# EAGLE design reader (EAGLE 9.1.0)
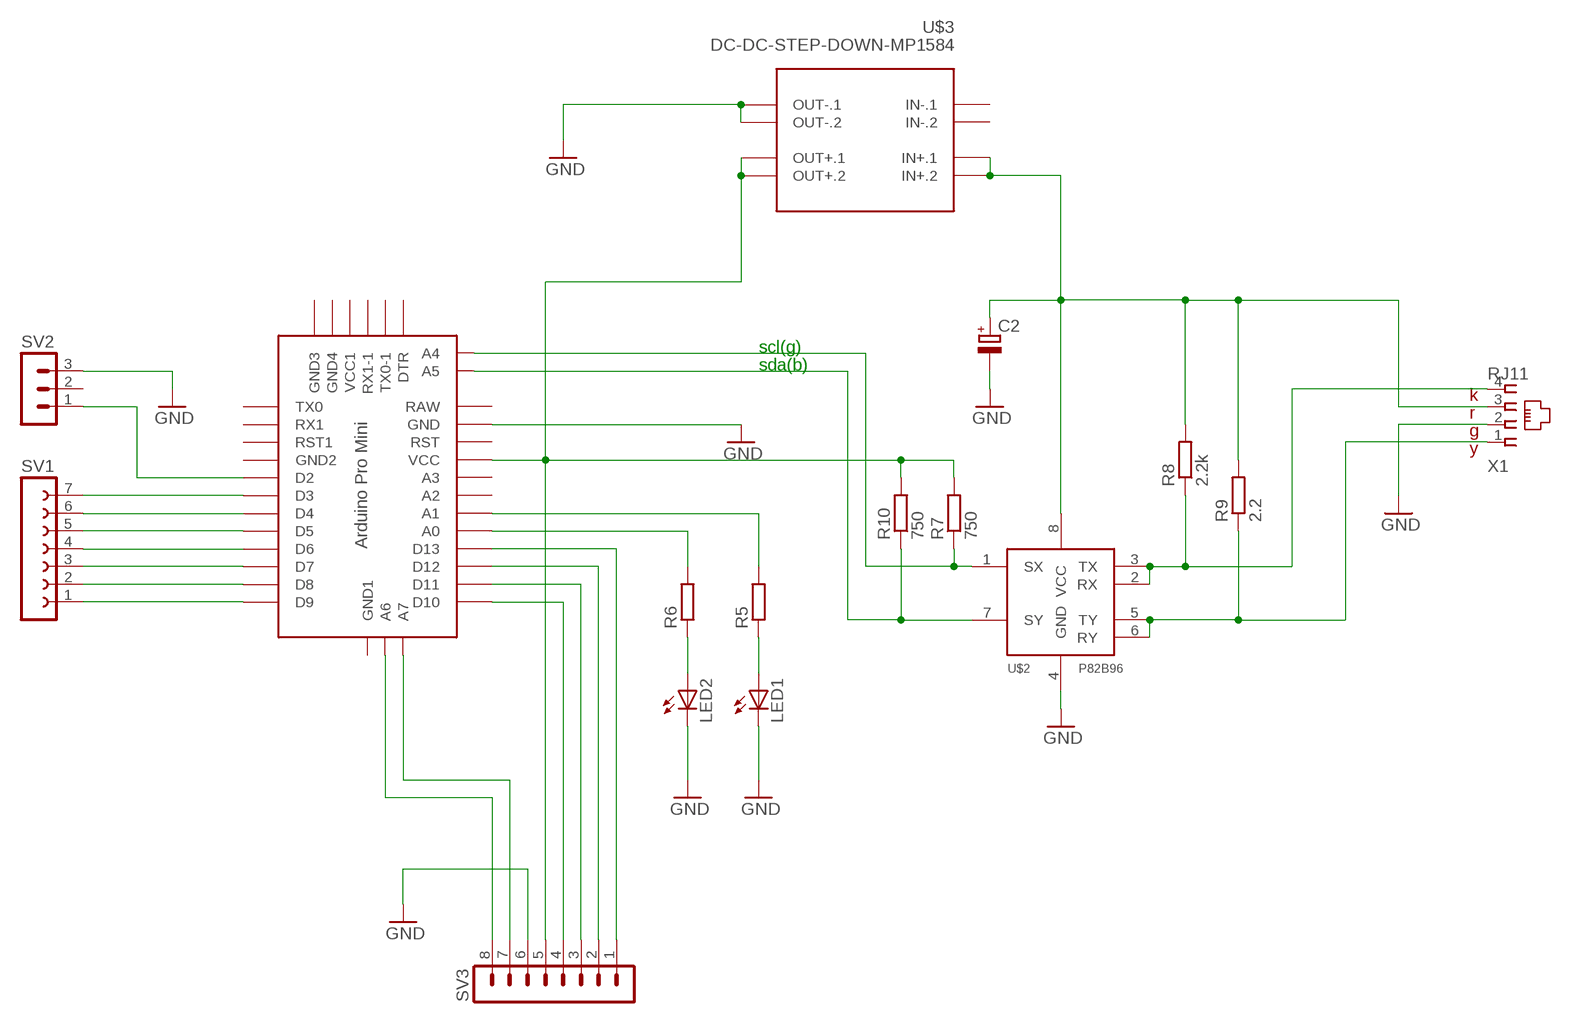
[diagram p0: schematic, sheet 1]

## Parts
C2  CPOL-EUE5-6  [E5-6]
LED1  LEDB152  [Q62902-B152]
LED2  LEDB152  [Q62902-B152]
R5  R-EU_M1206  [M1206]
R6  R-EU_M1206  [M1206]
R7  750  R-EU_M1206  [M1206]
R8  2.2k  R-EU_M1206  [M1206]
R9  2.2  R-EU_M1206  [M1206]
R10  750  R-EU_M1206  [M1206]
SV1  FE07-1  [FE07]
SV2  MA03-1  [MA03-1]
SV3  MA08-1  [MA08-1]
U$1  ABK-PRO-MINI  [ABK-PRO-MINI]
U$2  P82B96_  [SOIC8]
U$3  DC-DC-STEP-DOWN-MP1584  [DC-DC-STEP-DOWN-MP1584]
X1  RJ11  [RJ11-4P4C]

## Nets
GND: C2.- LED1.K(C) LED2.K(C) SV2.3 SV3.6 U$1.GND U$2.4(GND) U$3.OUT-.1 U$3.OUT-.2 X1.2
N$1: SV1.1 U$1.D9
N$3: R7.1 U$1.A4 U$2.1(SX)
N$4: R10.1 U$1.A5 U$2.7(SY)
N$5: R8.1 U$2.2(RX) U$2.3(TX) X1.4
N$6: SV3.1 U$1.D13
N$7: R9.1 U$2.5(TY) U$2.6(RY) X1.1
N$8: SV1.2 U$1.D8
N$9: C2.+ R8.2 R9.2 U$2.8(VCC) U$3.IN+.1 U$3.IN+.2 X1.3
N$10: SV1.3 U$1.D7
N$11: SV1.4 U$1.D6
N$12: SV1.5 U$1.D5
N$13: SV1.6 U$1.D4
N$14: SV1.7 U$1.D3
N$15: SV3.2 U$1.D12
N$16: SV2.1 U$1.D2
N$17: R5.2 U$1.A1
N$18: R6.2 U$1.A0
N$19: LED1.A R5.1
N$20: LED2.A R6.1
N$21: SV3.3 U$1.D11
N$22: R7.2 R10.2 SV3.5 U$1.VCC U$3.OUT+.1 U$3.OUT+.2
N$23: SV3.4 U$1.D10
N$24: SV3.7 U$1.A7
N$25: SV3.8 U$1.A6
Unconnected: SV2.2 U$1.A2 U$1.A3 U$1.DTR U$1.GND1(GND2) U$1.GND2(GND3) U$1.GND3(GND4) U$1.GND4(GND1) U$1.RAW U$1.RST U$1.RST1 U$1.RX1 U$1.RX1-1 U$1.TX0 U$1.TX0-1 U$1.VCC1 U$3.IN-.1 U$3.IN-.2

## Notes on the sheet
- scl(g)
- sda(b)

## Library data of the parts
C2 = rcl:CPOL-EU: POLARIZED CAPACITOR, European symbol; SPICEPREFIX: C
LED1 LED2 = led:LED: LED OSRAM: - CHIPLED LG R971, LG N971, LY N971, LG Q971, LY Q971, LO R971, LY R971 LH N974, LH R974 LS Q976, LO Q976, LY Q976 LO Q996 - Hyper CHIPLED LW Q18S LB Q993, LB Q99A, LB R99A - SideLED LS A670, LO A670, LY A670, LG A670, LP A670 LB A673, LV A673, LT A673, LW A673 LH A674 LY A675 LS A676, LA A676, LO A676, LY A676, LW A676 LS A679, LY A679, LG A679 - Hyper Micro SIDELED® LS Y876, LA Y876, LO Y876, LY Y876 LT Y87S - SmartLED LW L88C, LW L88S LB L89C, LB L89S, LG L890 LS L89K, LO L89K, LY L89K LS L896, LA L896, LO L896, LY L896 - TOPLED LS T670, LO T670, LY T670, LG T670, LP T670 LSG T670, LSP T670, LSY T670, LOP T670, LYG T670 LG T671, LOG T671, LSG T671 LB T673, LV T673, LT T673, LW T673 LH T674 LS T676, LA T676, LO T676, LY T676, LB T676, LH T676, LSB T676, LW T676 LB T67C, LV T67C, LT T67C, LS T67K, LO T67K, LY T67K, LW E67C LS E67B, LA E67B, LO E67B, LY E67B, LB E67C, LV E67C, LT E67C LW T67C LS T679, LY T679, LG T679 LS T770, LO T770, LY T770, LG T770, LP T770 LB T773, LV T773, LT T773, LW T773 LH T774 LS E675, LA E675, LY E675, LS T675 LS T776, LA T776, LO T776, LY T776, LB T776 LHGB T686 LT T68C, LB T68C - Hyper Mini TOPLED® LB M676 - Mini TOPLED Santana® LG M470 LS M47K, LO M47K, LY M47K Source: http://www.osram.convergy.de LUXEON: - LUMILED® LXK2-PW12-R00, LXK2-PW12-S00, LXK2-PW14-U00, LXK2-PW14-V00 LXK2-PM12-R00, LXK2-PM12-S00, LXK2-PM14-U00 LXK2-PE12-Q00, LXK2-PE12-R00, LXK2-PE12-S00, LXK2-PE14-T00, LXK2-PE14-U00 LXK2-PB12-K00, LXK2-PB12-L00, LXK2-PB12-M00, LXK2-PB14-N00, LXK2-PB14-P00, LXK2-PB14-Q00 LXK2-PR12-L00, LXK2-PR12-M00, LXK2-PR14-Q00, LXK2-PR14-R00 LXK2-PD12-Q00, LXK2-PD12-R00, LXK2-PD12-S00 LXK2-PH12-R00, LXK2-PH12-S00 LXK2-PL12-P00, LXK2-PL12-Q00, LXK2-PL12-R00 Source: www.luxeon.com KINGBRIGHT: KA-3528ASYC Source: www.kingbright.com
R5-R10 = rcl:R-EU_: RESISTOR, European symbol; SPICEPREFIX: R
SV1 = con-lsta:FE07-1: FEMALE HEADER; OC_FARNELL: unknown; OC_NEWARK: unknown
SV2 = con-lstb:MA03-1: PIN HEADER; OC_FARNELL: unknown; OC_NEWARK: unknown
SV3 = con-lstb:MA08-1: PIN HEADER; OC_FARNELL: unknown; OC_NEWARK: unknown
U$1 = Arduino-clone:ABK-PRO-MINI: ABK Pro-Mini Arduino Clone
U$2 = P82B96:P82B96_: P82B96 - I2C buffer
U$3 = diy-modules:DC-DC-STEP-DOWN-MP1584: DC/DC Step-Down Regulator based on MP1584 chip MP1584 datasheet available here: http://www.haoyuelectronics.com/Attachment/MP1584/MP1584.pdf Click here to find device on ebay.com <http://www.ebay.com/sch/mp1584+module>
X1 = con-4ucon:RJ11: RJ11 Connector Source: 4UCON TECHNOLOGY INC. 14867.pdf; OC_FARNELL: unknown; OC_NEWARK: unknown

## Board
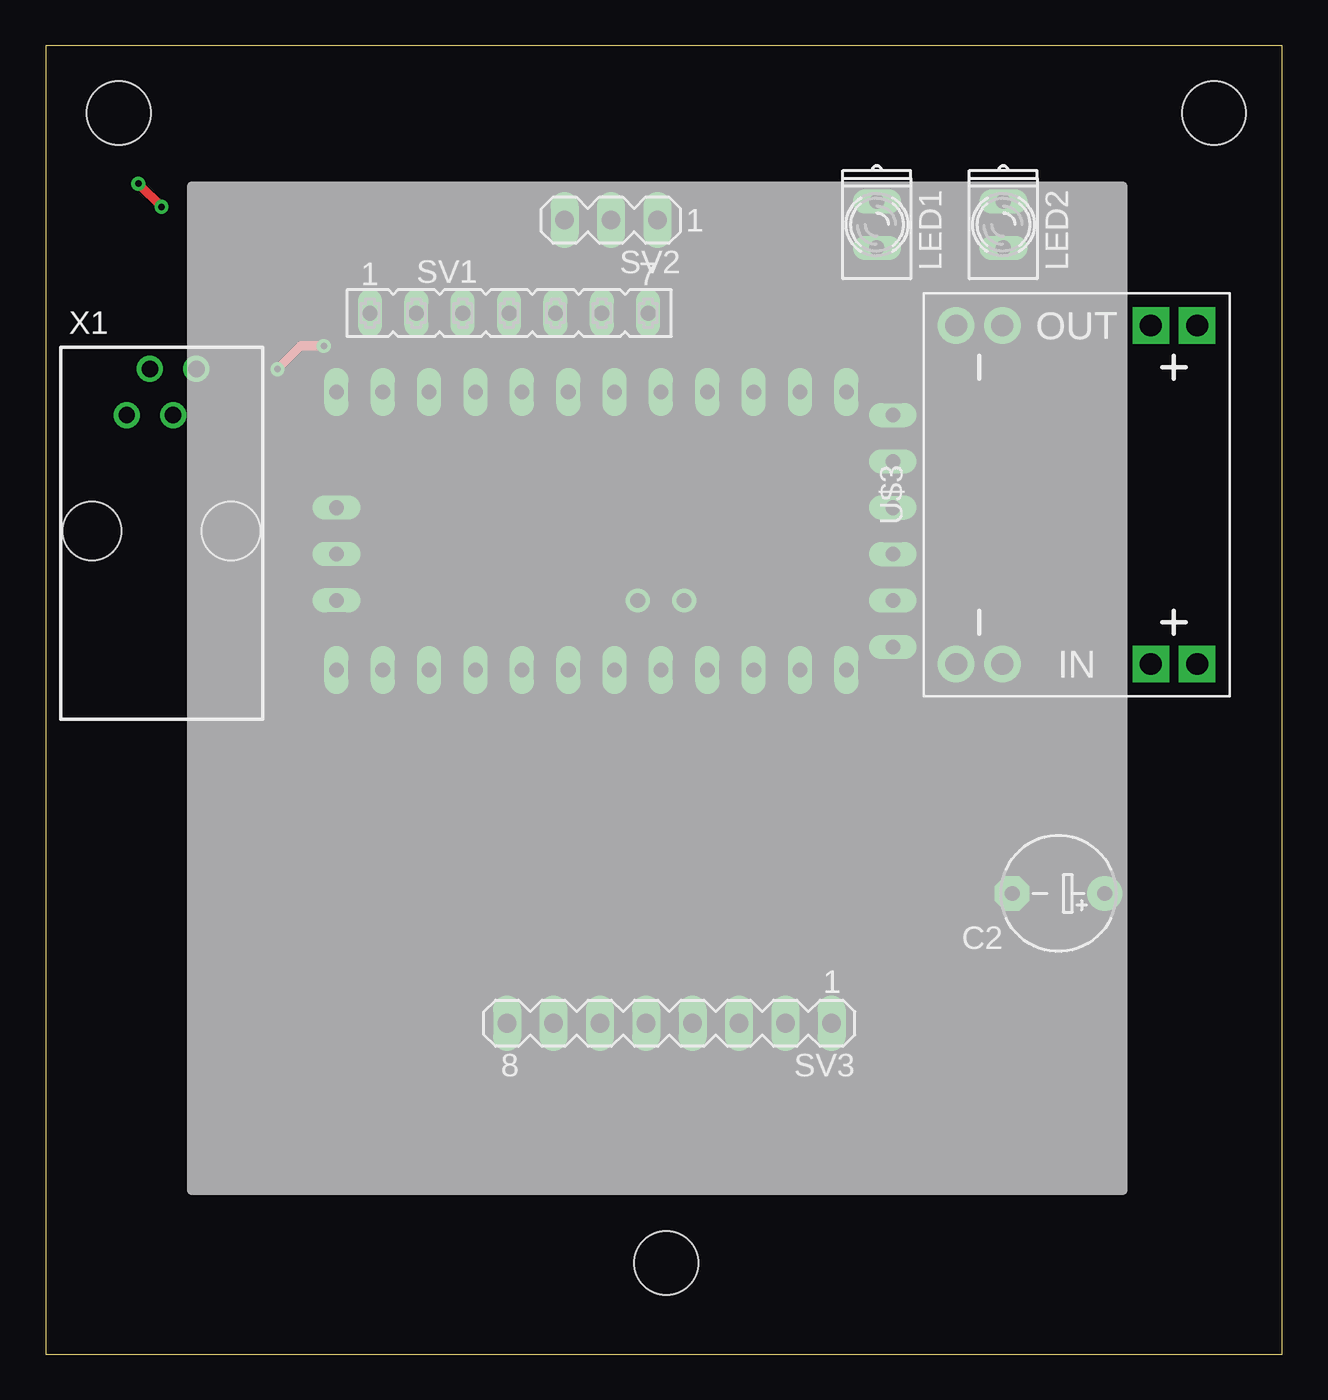
[diagram p1: board, top side]
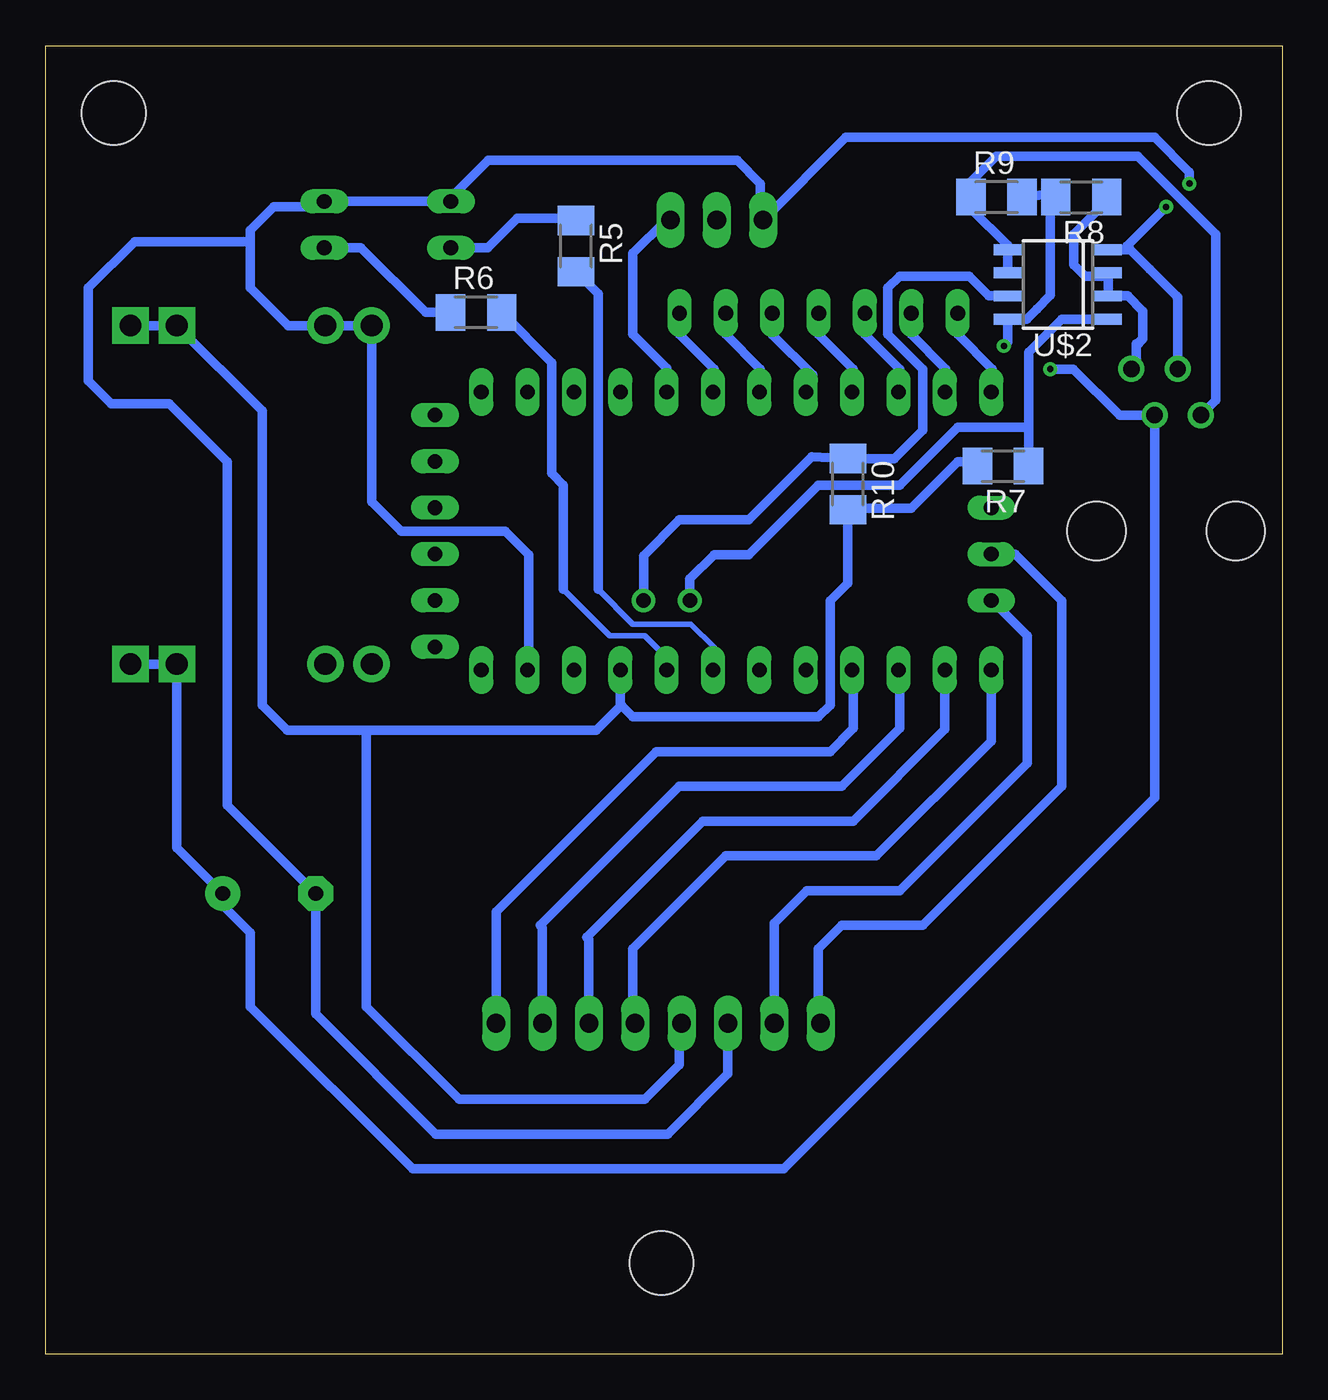
[diagram p2: board, bottom side, seen from below]

Size 67.73 x 71.69 mm. Coordinates in mm from the lower left corner, seen from the top.
Outline: 0,0 67.73,0 67.73,71.69 0,71.69 0,0
Copper layers (1*16): Top 0.035mm / dielectric 1.5mm / Bottom 0.035mm
Design rules "default": minimum track width 6mil, minimum drill 0.35mm, track to track 6mil, track to pad 6mil, pad to pad 6mil, via to via 6mil, smd to smd 6mil, copper to edge 40mil, drill to drill 6mil, minimum pad ring 10mil, minimum via ring 8mil, stop-mask expansion 4mil, vias tented up to drill 0mil, thermal gap 10mil
Holes 3.5 mm at 4,68 34,5 64,68

### Footprints (pad centres in the part's own frame; a part is rotated, then mirrored left to right if it is on the bottom)
E5-6 = drill 0.813 pad 1.905: + -2.54,0 | drill 0.813 pad 1.905 octagon: - 2.54,0
Q62902-B152 = drill 0.813 long: A 1.27,0; K -1.27,0
M1206 = smd 1.6 x 2: 1 -1.4,0; 2 1.4,0
FE07 = drill 0.813 long: 1 -7.62,0; 2 -5.08,0; 3 -2.54,0; 4 0,0; 5 2.54,0; 6 5.08,0; 7 7.62,0
MA03-1 = drill 1.016 long: 1 -2.54,0; 2 0,0; 3 2.54,0
MA08-1 = drill 1.016 long: 1 -8.89,0; 2 -6.35,0; 3 -3.81,0; 4 -1.27,0; 5 1.27,0; 6 3.81,0; 7 6.35,0; 8 8.89,0
ABK-PRO-MINI = drill 0.8 long: A0 10.16,-3.81; A1 10.16,-6.35; A2 10.16,-8.89; A3 10.16,-11.43; A6 3.81,-21.59; A7 6.35,-21.59; D2 -5.08,-3.81; D3 -5.08,-6.35; D4 -5.08,-8.89; D5 -5.08,-11.43; D6 -5.08,-13.97; D7 -5.08,-16.51; D8 -5.08,-19.05; D9 -5.08,-21.59; D10 10.16,-21.59; D11 10.16,-19.05; D12 10.16,-16.51; D13 10.16,-13.97; DTR 8.89,8.89; GND 10.16,3.81; GND1 -5.08,-1.27; GND2 -3.81,8.89; GND3 -1.27,8.89; GND4 1.27,-21.59; RAW 10.16,6.35; RST 10.16,1.27; RST1 -5.08,1.27; RX1 -5.08,3.81; RX1-1 3.81,8.89; TX0 -5.08,6.35; TX0-1 6.35,8.89; VCC 10.16,-1.27; VCC1 1.27,8.89 | drill 0.8: A4 6.35,-5.08; A5 6.35,-2.54
SOIC8 = smd 0.6 x 1.5: 1 -1.905,-2.75; 2 -0.635,-2.75; 3 0.635,-2.75; 4 1.905,-2.75; 5 1.905,2.75; 6 0.635,2.75; 7 -0.635,2.75; 8 -1.905,2.75
DC-DC-STEP-DOWN-MP1584 = drill 1.2 pad 2 square: IN+.1 -9.271,-4.064; IN+.2 -9.271,-6.604; OUT+.1 9.271,-4.064; OUT+.2 9.271,-6.604 | drill 1.2 pad 2: IN-.1 -9.271,6.604; IN-.2 -9.271,4.064; OUT-.1 9.271,6.604; OUT-.2 9.271,4.064
RJ11-4P4C = drill 0.9 pad 1.422: 1 -1.905,6.35; 2 -0.635,8.89; 3 0.635,6.35; 4 1.905,8.89 | hole 3.2: -3.81,0; 3.81,0

### Placement (x,y rotation side)
C2  55.48,25.25 180 top
LED1  45.53,61.89 270 top
LED2  52.47,61.89 270 top
R5  38.68,60.72 270 bottom
R6  44.16,57.08 0 bottom
R7  15.29,48.66 180 bottom
R8  11,63.39 180 bottom
R9  15.64,63.39 0 bottom
R10  23.79,47.67 270 bottom
SV1  25.39,57.04 0 top
SV2  30.97,62.13 180 top
SV3  34.17,18.14 180 top
U$1  37.52,47.65 270 top
U$2  12.29,58.62 90 bottom
U$3  56.48,47.09 90 top
X1  6.35,45.1 0 top

### Tracks (layer width: path | path; a pad name or v marks a point on that pad's centre or on a via)
GND  (via drill 0.35)
  Top 0.508: v5.08,64.14 v6.35,62.87
  Bottom 0.508: X1.2 5.71,57.91 5.79,57.98 7.24,59.43 | LED1.K 45.72,63.16 | 45.72,63.16 LED2.K 52.76,62.87 55.24,62.87 56.52,61.59 56.52,60.96 | 56.52,60.96 56.52,58.42 54.46,56.36 U$3.OUT-.2 U$3.OUT-.1 49.88,46.7 48.26,45.09 42.55,45.09 41.27,43.81 41.27,37.55 U$1.GND | 7.24,59.43 8.51,60.7 v6.35,62.87 | 7.24,59.43 8.33,60.52 U$2.4 | 56.52,60.96 62.87,60.96 65.41,58.42 65.41,53.34 64.14,52.07 60.96,52.07 57.78,48.9 57.78,30.09 C2.- 52.95,18.66 46.35,12.06 33.66,12.06 30.36,15.36 SV3.6 | 45.72,63.16 43.48,65.41 29.84,65.41 28.57,64.14 28.57,63.5 28.43,63.35 SV2.3 23.89,66.67 6.99,66.67 5.08,64.77 v5.08,64.14
N$1
  Bottom 0.508: U$1.D9 15.93,53.28 15.88,53.34 15.88,53.98 17.78,55.88 SV1.1
N$3
  Bottom 0.508: U$1.A4 32.44,42.49 31.11,43.81 29.21,43.81 25.4,47.62 20.95,47.62 17.78,50.8 14.53,50.8 13.89,50.8 | 13.89,49.29 R7.1 13.89,50.8 | 13.89,50.8 13.89,54.9 12.07,56.71 U$2.1
N$4
  Bottom 0.508: U$2.7 16.07,57.98 17.14,59.05 20.95,59.05 21.59,58.42 21.59,55.88 19.68,53.98 19.68,50.63 21.25,49.08 R10.1 25.77,49.16 29.21,45.72 33.02,45.72 34.98,43.76 U$1.A5
N$5
  Bottom 0.508: X1.4 8,54.24 8,55.24 | 8,55.24 8,55.37 | 8,55.24 7.62,55.62 7.62,57.15 8.45,57.98 U$2.2 9.54,59.05 | 9.54,59.05 U$2.3 | 9.54,59.05 10.77,59.05 11.4,59.69 11.4,61.37 9.6,63.18 R8.1
N$6
  Bottom 0.508: SV3.1 43.06,24.25 34.29,33.02 24.77,33.02 23.5,34.29 23.5,37.44 U$1.D13
N$7
  Bottom 0.508: X1.1 3.63,52.26 3.63,61.37 7.91,65.64 15.64,65.64 17.05,64.23 R9.1 17.05,62.77 15.04,60.76 U$2.5 U$2.6
N$8
  Bottom 0.508: U$1.D8 18.47,53.92 18.41,53.98 20.32,55.88 SV1.2
N$9  (via drill 0.35)
  Top 0.508: v15.24,55.24 13.97,55.24 v12.7,53.98
  Bottom 0.508: U$3.IN+.2 U$3.IN+.1 60.54,27.76 C2.+ 58.02,24.61 56.52,23.1 56.52,19.05 47.62,10.16 27.3,10.16 6.99,30.48 | R9.2 12.6,63.59 R8.2 12.7,63.09 12.7,58.01 13.45,57.26 14,56.71 U$2.8 15.04,55.45 v15.24,55.24 | 6.99,30.48 X1.3 8.9,51.45 11.43,53.98 v12.7,53.98 | 6.99,30.48
N$10
  Bottom 0.508: U$1.D7 21.01,53.28 20.95,53.34 20.95,53.98 22.86,55.88 SV1.3
N$11
  Bottom 0.508: U$1.D6 23.55,53.92 23.5,53.98 25.4,55.88 SV1.4
N$12
  Bottom 0.508: U$1.D5 26.09,53.28 25.72,53.66 27.93,55.87 SV1.5
N$13
  Bottom 0.508: U$1.D4 28.63,53.92 28.57,53.98 30.48,55.88 SV1.6
N$14
  Bottom 0.508: U$1.D3 31.17,53.92 31.11,53.98 33.02,55.88 SV1.7
N$15
  Bottom 0.508: SV3.2 40.52,23.38 40.64,23.5 33.02,31.11 24.13,31.11 20.95,34.29 20.95,37.44 U$1.D12
N$16
  Bottom 0.508: U$1.D2 33.71,54.03 35.56,55.88 35.56,60.33 33.75,62.13 SV2.1
N$17
  Bottom 0.305: 37.47,41.91 35.56,40.01 32.38,40.01 31.11,38.73 31.11,37.55 U$1.A1
  Bottom 0.508: R5.2 37.47,58.1 37.47,41.91
N$18
  Bottom 0.305: 39.37,41.91 37.47,40.01 36.83,39.37 34.92,39.37 33.71,38.16 U$1.A0
  Bottom 0.508: R6.2 40.01,54.33 40.01,48.9 40.01,48.26 39.37,47.62 39.37,41.91
N$19
  Bottom 0.508: LED1.A 43.52,60.62 41.91,62.23 38.8,62.23 R5.1
N$20
  Bottom 0.508: LED2.A 50.46,60.62 46.92,57.08 R6.1
N$21
  Bottom 0.508: SV3.3 37.98,22.74 38.1,22.86 31.75,29.21 23.5,29.21 18.47,34.23 U$1.D11
N$22
  Bottom 0.508: U$3.OUT+.2 61.59,56.36 U$3.OUT+.1 55.88,51.7 55.88,35.56 54.5,34.18 50.16,34.18 | 36.25,35.51 U$1.VCC | 50.16,34.18 37.58,34.18 36.25,35.51 | SV3.5 33.02,18.02 33.02,15.88 34.92,13.97 45.09,13.97 50.16,19.05 50.16,34.18 | 36.25,35.51 36.14,35.51 35.56,34.92 25.4,34.92 24.77,35.56 24.77,41.27 23.79,42.26 R10.2 23.52,46.54 23.27,46.35 20.32,46.35 17.78,48.9 17.09,48.9 16.86,48.66 R7.2
N$23
  Bottom 0.508: SV3.4 35.56,18.26 35.56,22.23 30.48,27.3 22.23,27.3 15.93,33.6 U$1.D10
N$24
  Bottom 0.508: SV3.7 27.82,23.61 26.04,25.4 20.95,25.4 13.97,32.38 13.97,39.37 15.9,41.3 U$1.A7
N$25
  Bottom 0.508: SV3.8 25.4,18.26 25.4,22.23 24.13,23.5 19.68,23.5 12.06,31.11 12.06,41.27 14.63,43.84 U$1.A6